# Altium schematic sheet EE209_Schematic.SchDoc: Wireless Energy Monitor
size A3; Author: Team XX; Organization: EE/CS 209 Class of 2022; Address1: Department of ECSE; Address2: The University of Auckland; Address3: 20 Symonds Street; Address4: Auckland, NZ; Revision: 1.0; SheetNumber: 1; SheetTotal: 1
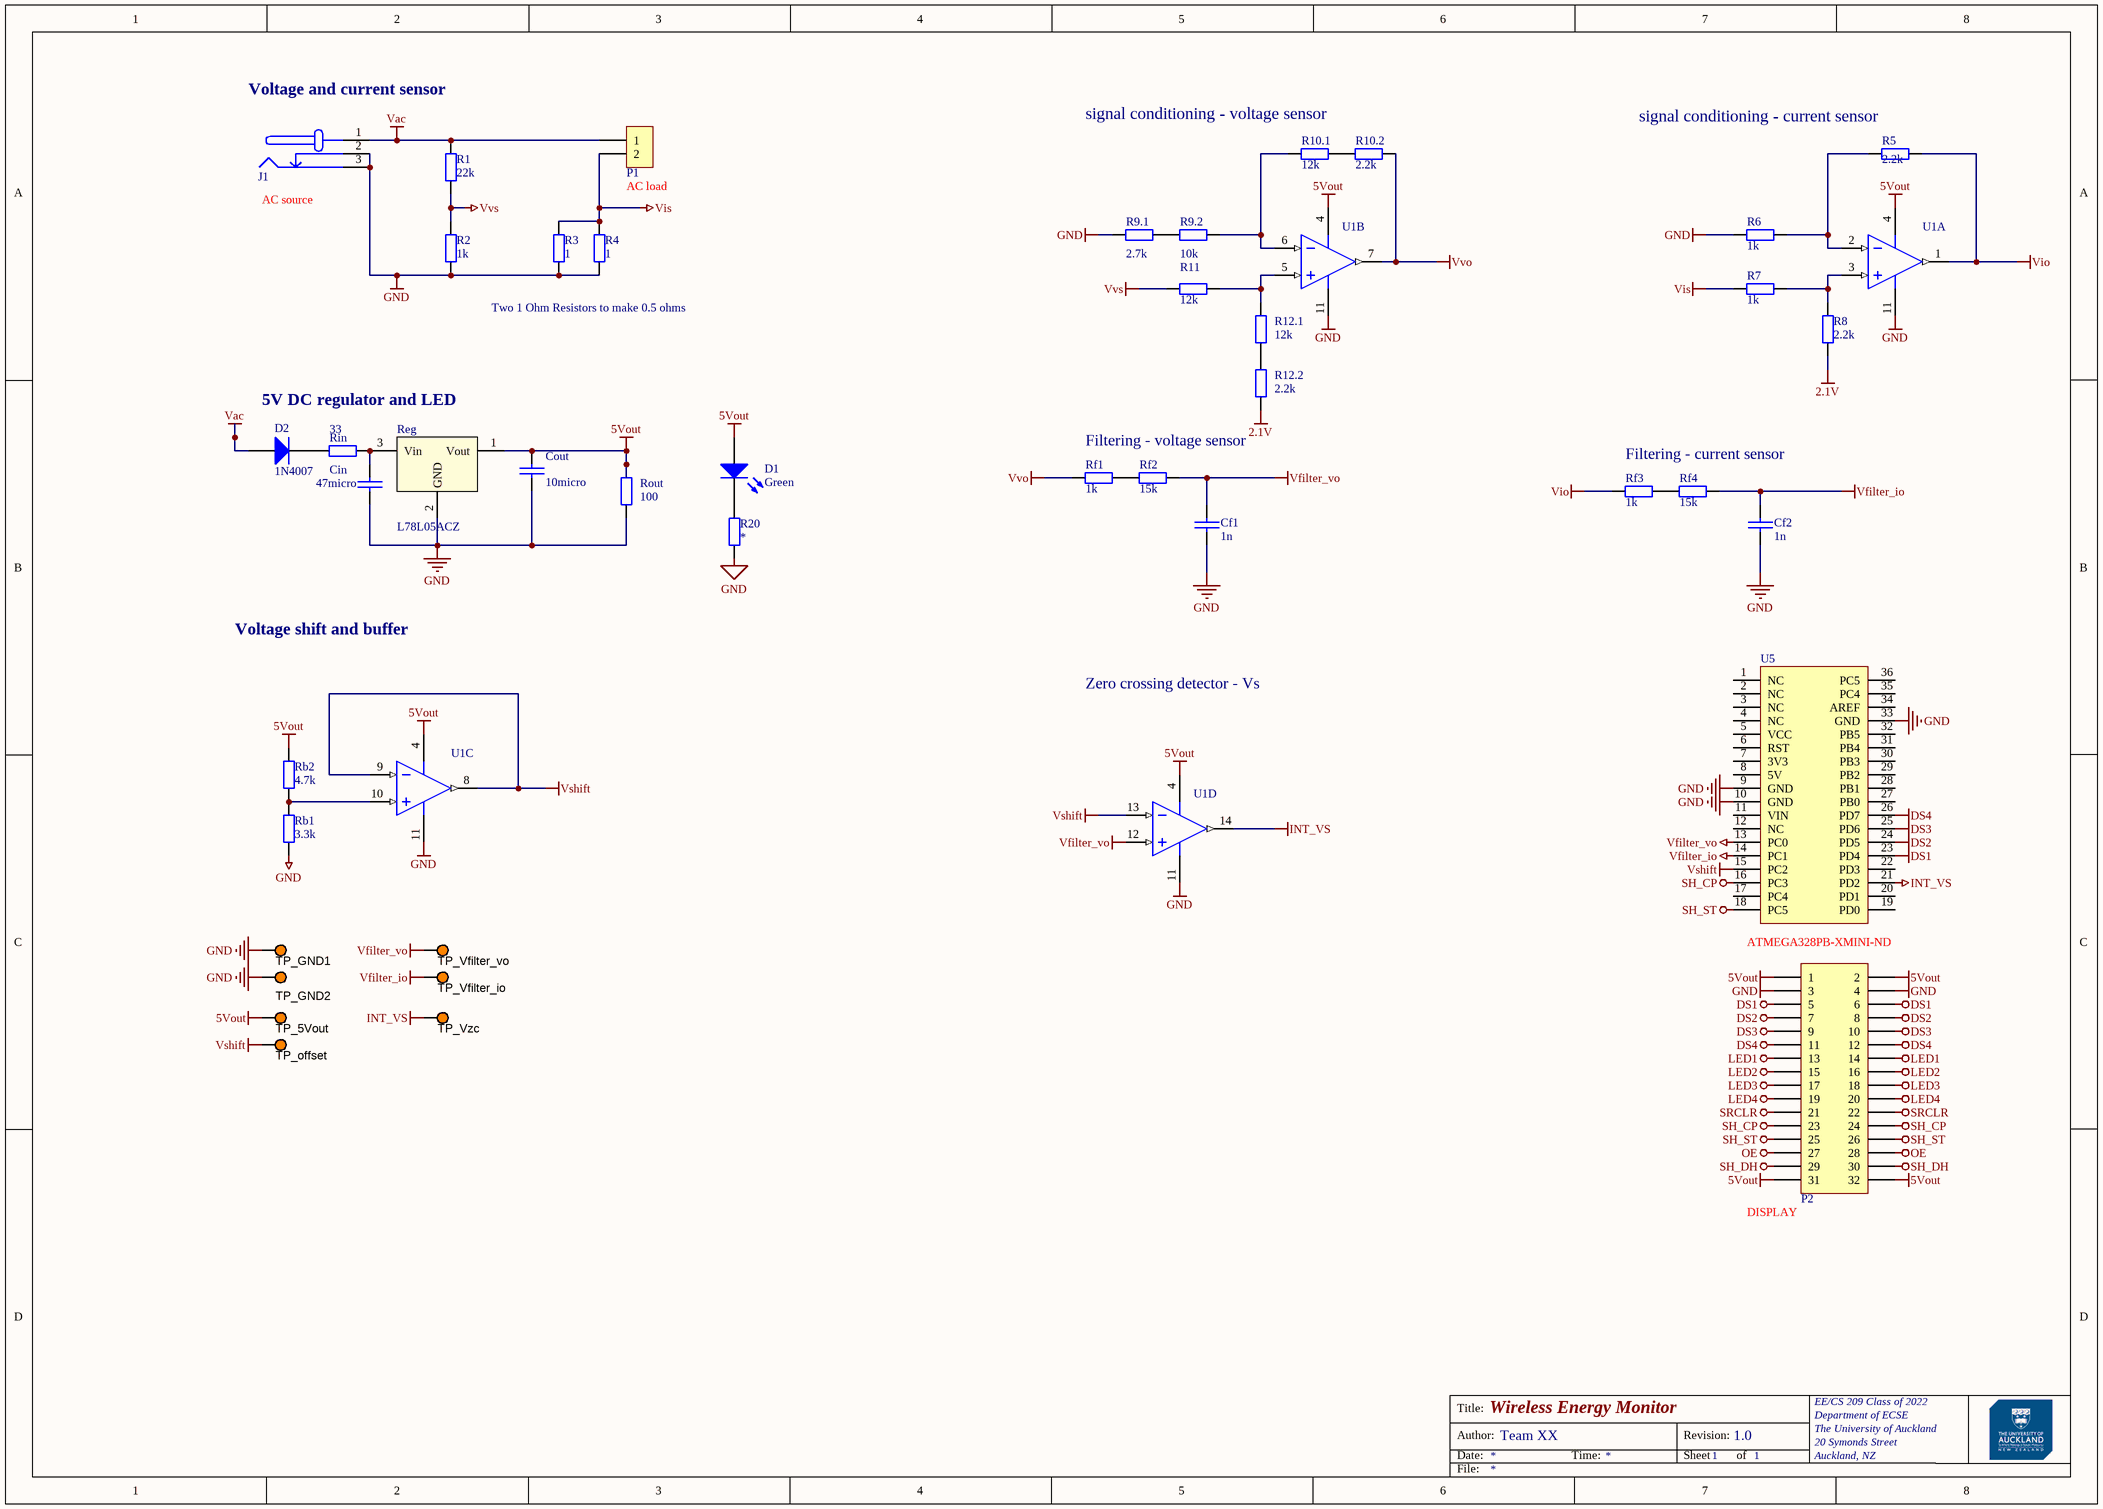
[diagram p0: EE209_Schematic.SchDoc]

## Parts
Cf1  1n  [CCAP-5P0]
Cf2  1n  [CCAP-5P0]
Cin  47micro  [CCAP-5P0]
Cout  10micro  [CCAP-5P0]
D1  Green  [LED]
D2  1N4007  [1N4007-MFG]
J1  DC barrel jack  [AC-Socket]  (value not drawn)
P1  Dual Banana Plugs  [Dual Banana Plug]  (value not drawn)
P2  Display  [Display]  (value not drawn)
R1  22k  [AXIAL-0.4]
R2  1k  [AXIAL-0.4]
R3  1  [AXIAL-0.4]
R4  1  [AXIAL-0.4]
R5  2.2k  [AXIAL-0.4]
R6  1k  [AXIAL-0.4]
R7  1k  [AXIAL-0.4]
R8  2.2k  [AXIAL-0.4]
R9.1  2.7k  [AXIAL-0.4]
R9.2  10k  [AXIAL-0.4]
R10.1  12k  [AXIAL-0.4]
R10.2  2.2k  [AXIAL-0.4]
R11  12k  [AXIAL-0.4]
R12.1  12k  [AXIAL-0.4]
R12.2  2.2k  [AXIAL-0.4]
R20  *  [AXIAL-0.4]
Rb1  3.3k  [AXIAL-0.4]
Rb2  4.7k  [AXIAL-0.4]
Reg  L78L05ACZ  [TO-92]
Rf1  1k  [AXIAL-0.4]
Rf2  15k  [AXIAL-0.4]
Rf3  1k  [AXIAL-0.4]
Rf4  15k  [AXIAL-0.4]
Rin  33  [AXIAL-0.4]
Rout  100  [AXIAL-0.4]
TP_5Vout  5003  [TP_TH]  (value not drawn)
TP_GND1  5003  [TP_TH]  (value not drawn)
TP_GND2  5003  [TP_TH]  (value not drawn)
TP_offset  5003  [TP_TH]  (value not drawn)
TP_Vfilter_io  5003  [TP_TH]  (value not drawn)
TP_Vfilter_vo  5003  [TP_TH]  (value not drawn)
TP_Vzc  5003  [TP_TH]  (value not drawn)
U1  LM324  [DIP-14]  (value not drawn)  (parts A,B,C,D of 4)
U5  Supplier Part Number 1: ATMEGA328PB-XMINI-ND  [ATmeg328P Xplained]  (hidden comment: ATmega328PB Xplained Mini Header)

## Nets
2.1V: R8.1 R12.2.1
5Vout: Cout.1 D1.1(A) P2.1 P2.2 P2.31 P2.32 Rb2.2 Reg.1(Vout) Rout.2 TP_5Vout.1 U1.4(VDD)
DS1: P2.5 P2.6 U5.23(PD4)
DS2: P2.7 P2.8 U5.24(PD5)
DS3: P2.9 P2.10 U5.25(PD6)
DS4: P2.11 P2.12 U5.26(PD7)
GND: Cf1.2 Cf2.2 Cin.2 Cout.2 J1.2(GND_ALT) J1.3(GND) P2.3 P2.4 R2.1 R3.1 R4.1 R6.1 R9.1.1 R20.1 Rb1.1 Reg.2(GND) Rout.1 TP_GND1.1 TP_GND2.1 U1.11(VSS) U5.9(GND) U5.10(GND) U5.33(GND)
INT_VS: TP_Vzc.1 U1.14(VOUTD) U5.21(PD2)
LED1: P2.13 P2.14
LED2: P2.15 P2.16
LED3: P2.17 P2.18
LED4: P2.19 P2.20
OE: P2.27 P2.28
SH_CP: P2.23 P2.24 U5.16(PC3)
SH_DH: P2.29 P2.30
SH_ST: P2.25 P2.26 U5.18(PC5)
SRCLR: P2.21 P2.22
Vac: D2.1(A) J1.1(VCC) P1.1 R1.2
Vfilter_io: Cf2.1 Rf4.2 TP_Vfilter_io.1 U5.14(PC1)
Vfilter_vo: Cf1.1 Rf2.2 TP_Vfilter_vo.1 U1.12(VIND+) U5.13(PC0)
Vio: R5.2 Rf3.1 U1.1(VOUTA)
Vis: P1.2 R3.2 R4.2 R7.1
Vshift: TP_offset.1 U1.8(VOUTC) U1.9(VINC-) U1.13(VIND-) U5.15(PC2)
Vvo: R10.2.2 Rf1.1 U1.7(VOUTB)
Vvs: R1.1 R2.2 R11.1
NetCin_1: Cin.1 Reg.3(Vin) Rin.2
NetD1_2: D1.2(K) R20.2
NetD2_2: D2.2(K) Rin.1
NetR5_1: R5.1 R6.2 U1.2(VINA-)
NetR7_2: R7.2 R8.2 U1.3(VINA+)
NetR9.1_2: R9.1.2 R9.2.1
NetR9.2_2: R9.2.2 R10.1.1 U1.6(VINB-)
NetR10.1_2: R10.1.2 R10.2.1
NetR11_2: R11.2 R12.1.2 U1.5(VINB+)
NetR12.1_1: R12.1.1 R12.2.2
NetRb1_2: Rb1.2 Rb2.1 U1.10(VINC+)
NetRf1_2: Rf1.2 Rf2.1
NetRf3_2: Rf3.2 Rf4.1

Not connected (* = marked no-connect by the designer): U5 1(NC) 2(NC) 3(NC) 4(NC) 5(VCC) 6(RST) 7(3V3) 8(5V) 11(VIN) 12(NC) 17(PC4) 19(PD0) 20(PD1) 22(PD3) 27(PB0) 28(PB1) 29(PB2) 30(PB3) 31(PB4) 32(PB5) 34(AREF) 35(PC4) 36(PC5)

## Notes on the sheet
- Voltage and current sensor
- signal conditioning - voltage sensor
- (near R5) signal conditioning - current sensor
- (near J1) AC source
- (near P1) AC load
- Two 1 Ohm Resistors to make 0.5 ohms
- 5V DC regulator and LED
- Filtering - voltage sensor
- Filtering - current sensor
- Voltage shift and buffer
- Zero crossing detector - Vs
- (near P2) DISPLAY
- Title:
- Author:
- Date:
- Time:
- Revision:
- Sheet
- of
- File:

## Library data of the parts
Cf1 Cf2 Cin Cout = CerCap_TH_5P0: TH ceramic capacitor with 5mm pitch
  Cf1 Cf2 Cout: Value: *
  Cin: Value: 47micro
D1 = LED_TH_2P54: Typical throughole GaAs LED with 2.54mm pitch; Manufacturer: Generic Components; Class I: Optoelectronic; Published: 8-Jun-2000; Revision: July-2002: Re-released for DXP Platform.; Publisher: Altium Limited; Class II: LED; Value: Green
D2 = 1N4007_TH_4AX0: 1N4007 1000V standard axial diode; ComponentLink1URL: https://www.fairchildsemi.com/datasheets/1N/1N914.pdf; ComponentLink1Description: https://www.fairchildsemi.com/datasheets/1N/1N914.pdf; Supplier 1: Digi-Key; Supplier Part Number 1: 1N4007RLGOSCT-ND
J1 = AC_Input: DC barrel jack connection to AC source; Value: socket
P1 = AC_Output: Dual banana plugs connection to the AC load; LatestRevisionDate: 17-Jul-2002; LatestRevisionNote: Re-released for DXP Platform.; Publisher: Altium Limited
P2 = Display: 16-Pin Header Connecting Display
R1 R5 R8 R10.1 R12.1 = Res_TH_0AX4: Through hole resistor; Value: 100k; Published: 8-Jun-2000; LatestRevisionDate: 17-Jul-2002; LatestRevisionNote: Re-released for DXP Platform.; PackageReference: AXIAL-0.4; Publisher: Altium Limited; ComponentLink1Description: http://www.royalohm.com/pdf/product2017/PrecisionMetalMF.pdf
R2 = Res_TH_0AX4: Through hole resistor; Value: 1k2; Published: 8-Jun-2000; LatestRevisionDate: 17-Jul-2002; LatestRevisionNote: Re-released for DXP Platform.; PackageReference: AXIAL-0.4; Publisher: Altium Limited; ComponentLink1Description: http://www.royalohm.com/pdf/product2017/PrecisionMetalMF.pdf
R3 R4 R9.1 R9.2 R10.2 R12.2 R20 Rb1 Rb2 Rf1-Rf4 Rin Rout = Res_TH_0AX4: Through hole resistor; Published: 8-Jun-2000; LatestRevisionDate: 17-Jul-2002; LatestRevisionNote: Re-released for DXP Platform.; PackageReference: AXIAL-0.4; Publisher: Altium Limited; ComponentLink1Description: http://www.royalohm.com/pdf/product2017/PrecisionMetalMF.pdf
  R3 R4: Value: 1
  R9.1 R10.2 R12.2 R20 Rb1 Rb2 Rf1-Rf4 Rin Rout: Value: *
  R9.2: Value: 10k
R6 R7 R11 = Res_TH_0AX4: Through hole resistor; Value: 10k; Published: 8-Jun-2000; LatestRevisionDate: 17-Jul-2002; LatestRevisionNote: Re-released for DXP Platform.; PackageReference: AXIAL-0.4; Publisher: Altium Limited; ComponentLink1Description: http://www.royalohm.com/pdf/product2017/PrecisionMetalMF.pdf
Reg = L78L05_TH_TO92: Voltage Regulator 5V; Manufacturer: ON Semiconductor; Manufacturer Part Number: LM78L05ACZX; Output Configuration: Positive; Output Type: Fixed; Voltage - Input (Max): 30V; Current - Output: 100mA; PSRR: 80dB (120Hz); Protection Features: Over Temperature, Short Circuit; Supplier 1: Digi-Key; RoHS: RoHS Compliant; Category: Integrated Circuits (ICs); Stock 1: 7782; Pricing 1: 1=0.69, 10=0.517, 100=0.3226, 500=0.2207, 1000=0.16976 (NZD); Packaging: Cut Tape (CT); Part Status: Active; Voltage - Output (Min/Fixed): 5V; Voltage - Output (Max): -; Voltage Dropout (Max): -; Control Features: -; Operating Temperature: -40°C ~ 125°C; Mounting Type: Through Hole; Package / Case: TO-226-3, TO-92-3 (TO-226AA) (Formed Leads); Supplier Device Package: TO-92-3; Base Part Number: LM78L05; ComponentLink1URL: https://www.fairchildsemi.com/datasheets/MC/MC78L05A.pdf; ComponentLink1Description: https://www.fairchildsemi.com/datasheets/MC/MC78L05A.pdf; Supplier Part Number 1: LM78L05ACZXCT-ND
TP_5Vout TP_GND1 TP_GND2 TP_offset TP_Vfilter_io TP_Vfilter_vo TP_Vzc = TestPoint: Test Point, Orange, 1-Pin THD, RoHS; Peak Reverse Current: 600 uA; Forward Current: 3 A; Max Surge Current: 80 A; Forward Voltage: 1.08 V; Max Operating Temperature: 150 degC; PackageReference: 5003; Pins: 2; ComponentLink2URL: http://keyelco.com/userAssets/file/M65p56.pdf; PackageDescription: 1-Pin Through Hole Device, Dia 2.54 mm; Weight: 0.01 lb; Diameter: 5.3 mm; Mount: Through Hole; Package Quantity: 500; Packaging: Bulk; Min Operating Temperature: -65 degC; ComponentLink1Description: Manufacturer URL; Height: 0.25 inch; ComponentLink1URL: http://www.keyelco.com/; ComponentLink2Description: Datasheet; Width: 0.25 inch; REACH SVHC: No SVHC; RoHSCompliant: true; Radiation Hardening: No; Length: 9.5 mm; DatasheetVersion: Jun-15
U1 = LM324N_TH_DIP16: IC OPAMP GP 14DIP; Manufacturer: ON Semiconductor; Manufacturer Part Number: LM324N; Amplifier Type: General Purpose; Current - Supply: 1mA; Voltage - Supply, Single/Dual (±): 3 V ~ 32 V, ±1.5 V ~ 16 V; Supplier 1: Digi-Key; RoHS: RoHS Compliant; Category: Integrated Circuits (ICs); Stock 1: 2900; Pricing 1: 1=0.9, 10=0.775, 100=0.5789, 500=0.45482, 1000=0.35145 (NZD); Packaging: Tube; Part Status: Active; Output Type: -; Slew Rate: -; Operating Temperature: 0°C ~ 70°C; Mounting Type: Through Hole; Package / Case: 14-DIP (0.300", 7.62mm); Supplier Device Package: 14-DIP; Base Part Number: LM324; ComponentLink1URL: https://www.fairchildsemi.com/datasheets/LM/LM2902.pdf; ComponentLink1Description: https://www.fairchildsemi.com/datasheets/LM/LM2902.pdf; Supplier Part Number 1: LM324NFS-ND
U5 = ATmega328PBXplained_TH: Dual 18-pin headers connecting to ATmega328PB Xplained Mini; Manufacturer: Microchip Technology; Manufacturer Part Number: ATMEGA328PB-XMINI; Board Type: Evaluation Platform; Core Processor: AVR; Platform: ATmega328P Xplained Mini; Contents: Board(s); Supplier 1: Digi-Key; RoHS: RoHS Compliant; Category: Development Boards, Kits, Programmers; Stock 1: 454; Pricing 1: 1=15.11 (NZD); Part Status: Active; Type: MCU 8-Bit; Operating System: -; For Use With/Related Products: ATmega328P; Mounting Type: Fixed; ComponentLink1URL: http://www.microchip.com/mymicrochip/filehandler.aspx?ddocname=en589665; ComponentLink1Description: http://www.microchip.com/mymicrochip/filehandler.aspx?ddocname=en589665